# Altium schematic sheet I2C.SchDoc
size A4; DocumentNumber: 1; SheetNumber: 1
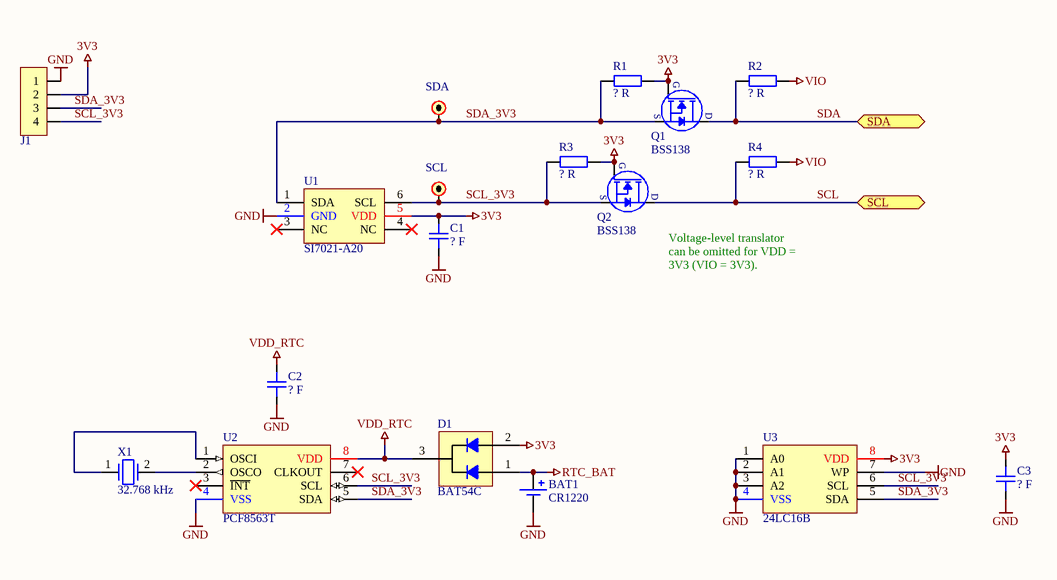
[diagram p0: I2C.SchDoc]

## Parts
BAT1  CR1220  [BC501SM]
C1  ? F  [0603C_RF_M]
C2  ? F  [0603C_RF_M]
C3  ? F  [0603C_RF_M]
D1  BAT54C  [IRLML_SOT-23]
J1  PINHDR-4P1  [HEADER-2.54-4P1]  (value not drawn)
Q1  BSS138  [IRLML_SOT-23]
Q2  BSS138  [IRLML_SOT-23]
R1  ? R  [R0603_RF_M]
R2  ? R  [R0603_RF_M]
R3  ? R  [R0603_RF_M]
R4  ? R  [R0603_RF_M]
TP1  SDA  [PAD_R_1MM]
TP2  SCL  [PAD_R_1MM]
U1  SI7021-A20  [SI7021_DFN-6_RF_M]
U2  PCF8563T  [SOIC-8]
U3  24LC16B  [SOIC-8]
X1  32.768 kHz  [XTAL_3215]

## Ports
SCL, SDA

## Nets
3V3: C1.2 C3.2 D1.2(A2) J1.2 Q1.1(G) Q2.1(G) R1.1 R3.1 U1.5(VDD) U3.8(VDD)
GND: BAT1.N C1.1 C2.1 C3.1 J1.1 U1.2(GND) U2.4(VSS) U3.1(A0) U3.2(A1) U3.3(A2) U3.4(VSS) U3.7(WP)
RTC_BAT: BAT1.P D1.1(A1)
VDD_RTC: C2.2 D1.3(C) U2.8(VDD)
VIO: R2.2 R4.1
SCL: Q2.3(D) R4.2 ; port SCL
SCL_3V3: J1.4 Q2.2(S) R3.2 TP2.1 U1.6(SCL) U2.6(SCL) U3.6(SCL)
SDA: Q1.3(D) R2.1 ; port SDA
SDA_3V3: J1.3 Q1.2(S) R1.2 TP1.1 U1.1(SDA) U2.5(SDA) U3.5(SDA)
NetU2_1: U2.1(OSCI) X1.1
NetU2_2: U2.2(OSCO) X1.2

Not connected (* = marked no-connect by the designer): U1 3(NC)* 4(NC)*; U2 3(~{INT})* 7(CLKOUT)*

## Notes on the sheet
- (near Q2) Voltage-level translator can be omitted for VDD = 3V3 (VIO = 3V3).
- Author
- Date
- Revision
- Size
- A4
- Sheet
- of

## Library data of the parts
BAT1 = BC501SM: Single Cell Battery; Nominal Voltage: 3V; Supplier: DigiKey; Supplier Part No: BC501SM-ND; Supplier Link: https://www.digikey.com/en/products/detail/mpd-memory-protection-devices/BC501SM/2439260; Mounting Technology: SMT; Suitable Battery: CR1220
C1-C3 = C: Capacitor; Manufacturer: Generic Brand; Max Voltage: ? V; Value: ? F; Tolerance: ?; Mounting Technology: SMT; Tag: *; Manufacturer Part No: *; Supplier: *; Supplier Link: http://; Supplier Part No: *; Category: Capacitor
D1 = BAT54C: DIODE ARRAY SCHOTTKY COMM CATH 30V 0.2A SOT-23; PartNo: BAT54C-FDICT-ND; Manufacturer: Diodes Incorporated; DiodeConfiguration: 1 Pair Common Cathode; ProductNumber: BAT54C-7-F; BaseProduct: BAT54C; Supplier: DigiKey; URL: https://www.digikey.com/en/products/detail/diodes-incorporated/BAT54C-7-F/717701; MountingTechnology: SMT; UnitPrice: $0.18; Package: SOT-23-3
J1 = PINHDR-4P1: Generic Pin Header 4x1
Q1 Q2 = BSS138: MOSFET N-CH 50V 200MA SOT23; Manufacturer: ON Semiconductor; Manufacturer Part No: BSS138LT1G; Supplier: DigiKey; Supplier Link: https://www.digikey.com/en/products/detail/on-semiconductor/BSS138L/5044751; Supplier Part No: BSS138LCT-ND; Mounting Technology: SMT; Package: SOT-23; Alternative Supplier: Chipdip; Alternative Supplier Part No: 457167271; Alternative Supplier Link: https://www.chipdip.by/product/bss138-onsemi
R1-R4 = R: Resistor; Manufacturer: Generic Brand; Power Rating: ? W; Max Voltage: ? V; Value: ? R; Tolerance: ?; Supplier Link: http://; Category: Resistor; Mounting Technology: SMT
TP1 TP2 = Test Point: Test Point / Pad
U1 = SI7021-A20: SENS HUMID/TEMP 3.6V I2C 2% 6DFN; Manufacturer Product Number: SI7021-A20-GM1R; Manufacturer: Silicon Labs; Supplier URL: https://www.digikey.com/en/products/detail/silicon-labs/SI7021-A20-GM1/5048934; Supplier Part No: 336-4380-1-ND; Supplier Package: Cut Tape (CT); Mounting Type: SMT; Package: DFN-6
X1 = KX-327NHT: Crystal Resonator (2 Leads); Manufacturer: Geyer; Load Capacitance: 12.5 pF; Tolerance: 20 ppm; Manufacturer Part No: KX-327NHT; Mounting Technology: SMT; Alternative Supplier: Belchip; Alternative Supplier Link: https://belchip.by/product/?selected_product=33387; Alternative Supplier Part No: 33387; Category: Crystal; Value: 32.768 kHz